# Altium schematic sheet IO.SchDoc
size A4
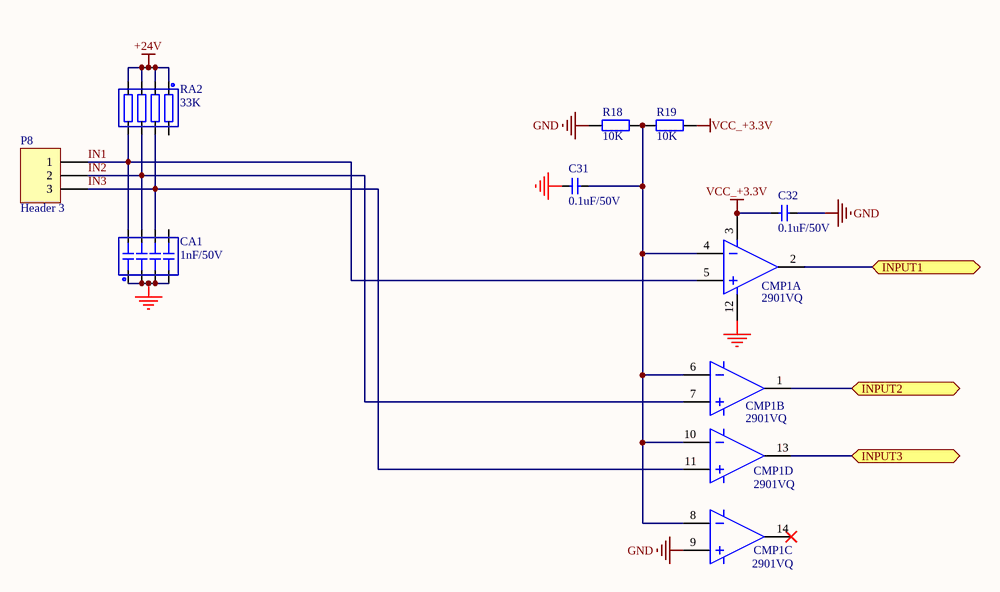
[diagram p0: IO.SchDoc]

## Parts
C31  0.1uF/50V  [0603c]
C32  0.1uF/50V  [0603C]
CA1  1nF/50V  [RES_PACK_SMD_E]
CMP1  2901VQ  [TSSOP14]  (parts A,B,C,D of 4)
P8  Header 3  [HT396  3P]
R18  10K  [0603R]
R19  10K  [0603R]
RA2  33K  [RES_PACK_SMD_E]

## Ports
INPUT1, INPUT2, INPUT3

## Nets
+24V: RA2.1 RA2.2 RA2.3 RA2.4
GND: C31.2 C32.2 CA1.1 CA1.2 CA1.3 CA1.4 CMP1.9 CMP1.12 R18.1
VCC_+3.3V: C32.1 CMP1.3 R19.2
IN1: CA1.8 CMP1.5 P8.1 RA2.5
IN2: CA1.7 CMP1.7 P8.2 RA2.6
IN3: CA1.6 CMP1.11 P8.3 RA2.7
INPUT1: CMP1.2 ; port INPUT1
INPUT2: CMP1.1 ; port INPUT2
INPUT3: CMP1.13 ; port INPUT3
NetC31_1: C31.1 CMP1.4 CMP1.6 CMP1.8 CMP1.10 R18.2 R19.1

Not connected (* = marked no-connect by the designer): CA1 5; CMP1 14*; RA2 8

## Library data of the parts
C31 C32 = CAP
CA1 = CAP_PACK4
CMP1 = LM339
P8 = Header 3: Header, 3-Pin; LatestRevisionDate: 17-Jul-2002; LatestRevisionNote: Re-released for DXP Platform.; Publisher: Altium Limited
R18 R19 = 0603R
RA2 = RESPACK4